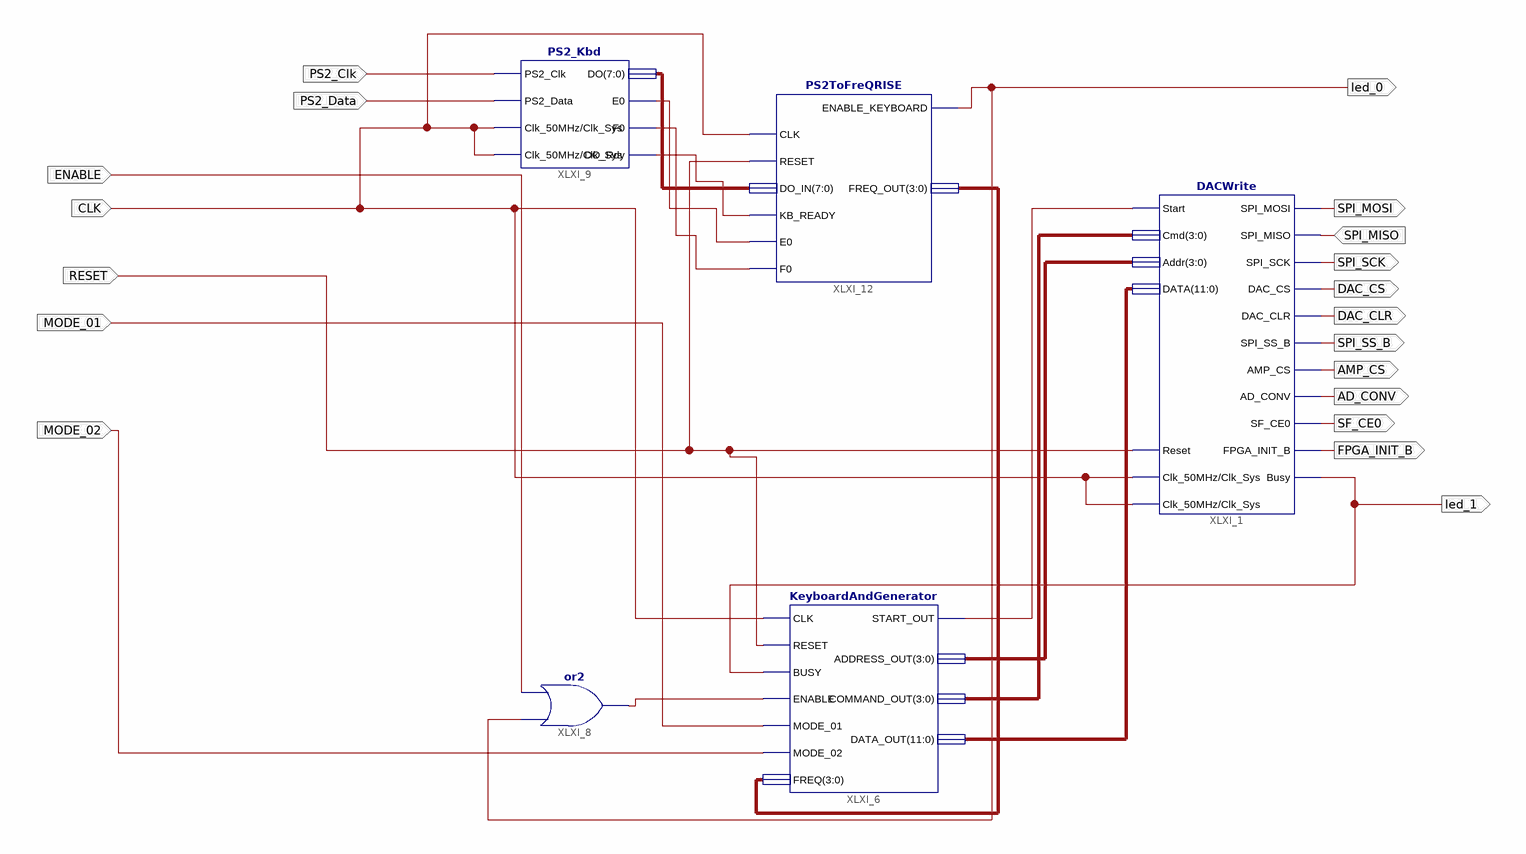
[diagram p0: schematic sheet 1]
// Xilinx ISE schematic schem.sch (spartan3e) as structural Verilog: 5 symbols, 19 ports
module schem (
  input  CLK,
  input  SPI_MISO,
  input  MODE_01,
  input  ENABLE,
  input  MODE_02,
  input  PS2_Clk,
  input  PS2_Data,
  input  RESET,
  output led_1,
  output FPGA_INIT_B,
  output SF_CE0,
  output AD_CONV,
  output AMP_CS,
  output SPI_SS_B,
  output DAC_CLR,
  output DAC_CS,
  output SPI_SCK,
  output SPI_MOSI,
  output led_0
);

  wire XLXN_19, XLXN_37, XLXN_38, XLXN_56, XLXN_70;
  wire [3:0] XLXN_8, XLXN_9, XLXN_53;
  wire [7:0] XLXN_24;
  wire [11:0] XLXN_4;

  DACWrite XLXI_1 (
    .Reset(RESET), .Start(XLXN_56), .SPI_MISO(SPI_MISO), .Cmd(XLXN_8), .Addr(XLXN_9), .DATA(XLXN_4),
    .DAC_CLR(DAC_CLR), .DAC_CS(DAC_CS), .SPI_MOSI(SPI_MOSI), .SPI_SCK(SPI_SCK), .SPI_SS_B(SPI_SS_B),
    .AMP_CS(AMP_CS), .AD_CONV(AD_CONV), .SF_CE0(SF_CE0), .FPGA_INIT_B(FPGA_INIT_B), .Busy(led_1),
    .Clk_50MHz(CLK), .Clk_Sys(CLK));
  KeyboardAndGenerator XLXI_6 (
    .CLK(CLK), .RESET(RESET), .BUSY(led_1), .ENABLE(XLXN_19), .MODE_01(MODE_01), .MODE_02(MODE_02),
    .FREQ(XLXN_53), .START_OUT(XLXN_56), .ADDRESS_OUT(XLXN_9), .COMMAND_OUT(XLXN_8), .DATA_OUT(XLXN_4));
  or XLXI_8 (XLXN_19, led_0, ENABLE);
  PS2_Kbd XLXI_9 (
    .PS2_Clk(PS2_Clk), .PS2_Data(PS2_Data), .Clk_50MHz(CLK), .E0(XLXN_37), .F0(XLXN_70), .DO_Rdy(XLXN_38),
    .DO(XLXN_24), .Clk_Sys(CLK));
  PS2ToFreQRISE XLXI_12 (
    .CLK(CLK), .RESET(RESET), .DO_IN(XLXN_24), .ENABLE_KEYBOARD(led_0), .FREQ_OUT(XLXN_53),
    .KB_READY(XLXN_38), .E0(XLXN_37), .F0(XLXN_70));
endmodule
